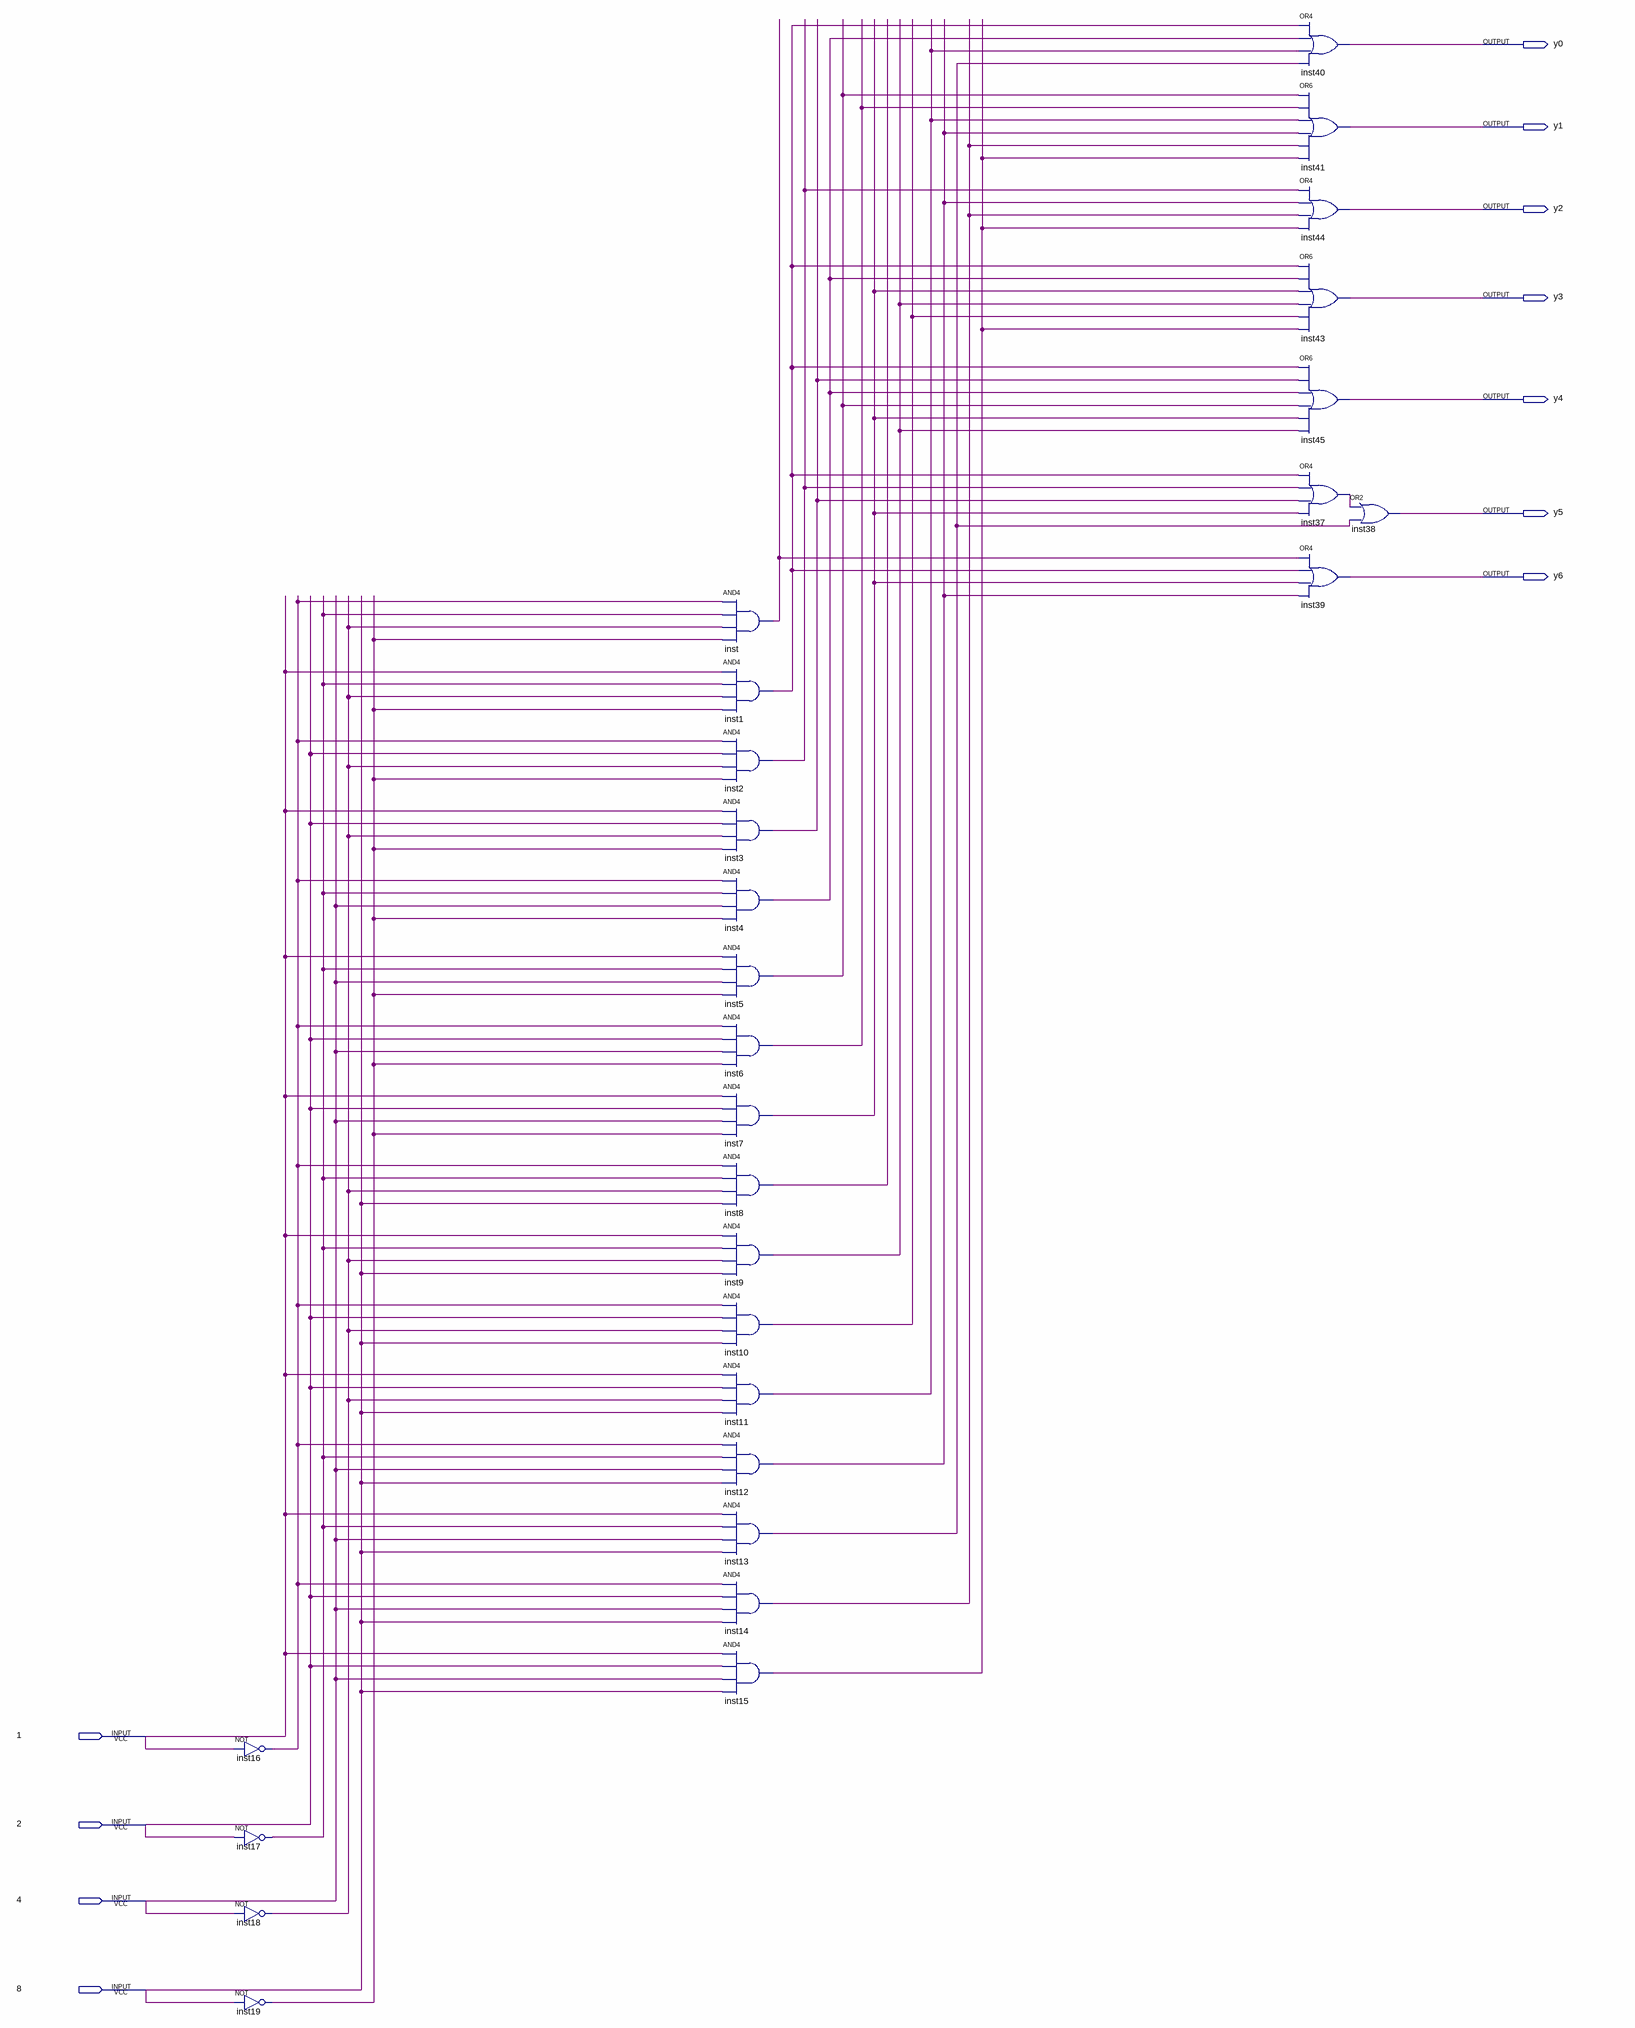
[diagram p0: schematic sheet]
// Quartus schematic aula04.bdf as structural Verilog: 28 symbols, 11 pins
module aula04 (
  input  \1 ,
  input  \2 ,
  input  \4 ,
  input  \8 ,
  output y0,
  output y1,
  output y2,
  output y3,
  output y4,
  output y5,
  output y6
);

  wire inst1_out, inst2_out, inst3_out, inst4_out, inst5_out, inst6_out, inst7_out, inst8_out, inst9_out,
       inst10_out, inst11_out, inst12_out, inst13_out, inst14_out, inst15_out, inst16_out, inst17_out,
       inst18_out, inst19_out, inst37_out, inst_out;

  not inst16 (inst16_out, \1 );
  not inst17 (inst17_out, \2 );
  not inst18 (inst18_out, \4 );
  not inst19 (inst19_out, \8 );
  and inst (inst_out, inst16_out, inst17_out, inst18_out, inst19_out);
  and inst1 (inst1_out, \1 , inst17_out, inst18_out, inst19_out);
  and inst2 (inst2_out, inst16_out, \2 , inst18_out, inst19_out);
  and inst3 (inst3_out, \1 , \2 , inst18_out, inst19_out);
  and inst4 (inst4_out, inst16_out, inst17_out, \4 , inst19_out);
  and inst5 (inst5_out, \1 , inst17_out, \4 , inst19_out);
  and inst6 (inst6_out, inst16_out, \2 , \4 , inst19_out);
  and inst7 (inst7_out, \1 , \2 , \4 , inst19_out);
  and inst8 (inst8_out, inst16_out, inst17_out, inst18_out, \8 );
  and inst9 (inst9_out, \1 , inst17_out, inst18_out, \8 );
  and inst10 (inst10_out, inst16_out, \2 , inst18_out, \8 );
  and inst11 (inst11_out, \1 , \2 , inst18_out, \8 );
  and inst12 (inst12_out, inst16_out, inst17_out, \4 , \8 );
  and inst13 (inst13_out, \1 , inst17_out, \4 , \8 );
  and inst14 (inst14_out, inst16_out, \2 , \4 , \8 );
  and inst15 (inst15_out, \1 , \2 , \4 , \8 );
  or inst40 (y0, inst1_out, inst4_out, inst11_out, inst13_out);
  or inst41 (y1, inst5_out, inst6_out, inst11_out, inst12_out, inst14_out, inst15_out);
  or inst44 (y2, inst2_out, inst12_out, inst14_out, inst15_out);
  or inst43 (y3, inst1_out, inst4_out, inst7_out, inst9_out, inst10_out, inst15_out);
  or inst45 (y4, inst1_out, inst3_out, inst4_out, inst5_out, inst7_out, inst9_out);
  or inst37 (inst37_out, inst1_out, inst2_out, inst3_out, inst7_out);
  or inst39 (y6, inst_out, inst1_out, inst7_out, inst12_out);
  or inst38 (y5, inst37_out, inst13_out);
endmodule
